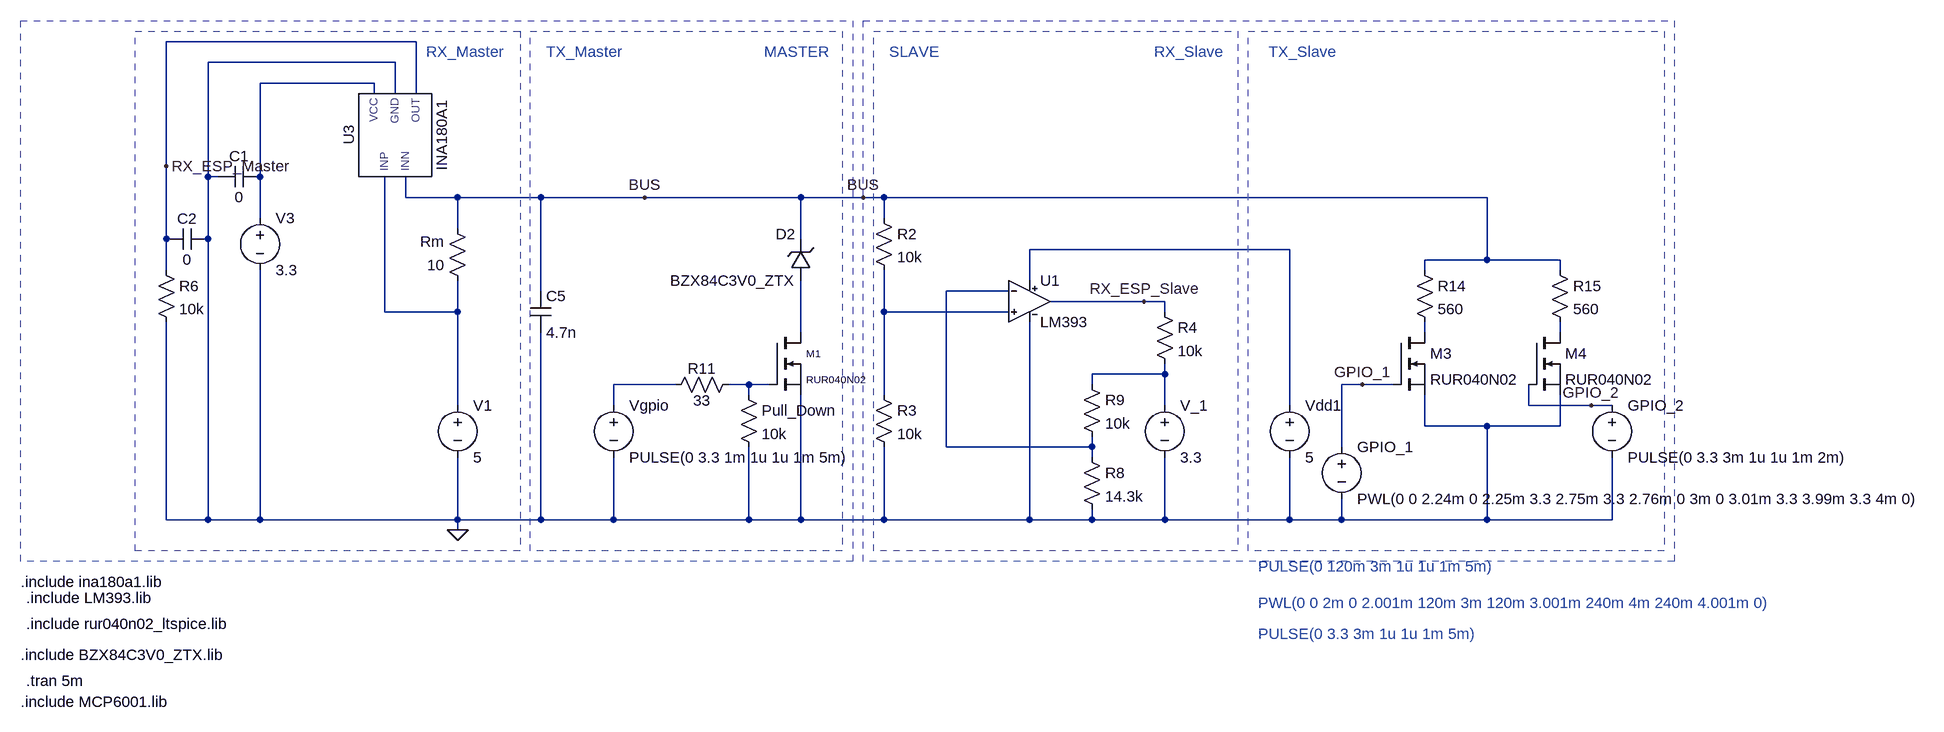
[diagram p0: schematic Master_Slave_Zwischenergebnis28052026.asc]
Master_Slave_Zwischenergebnis28052026.asc, the LTspice schematic file:
Version 4.1
SHEET 1 3916 744
WIRE -16 -288 -400 -288
WIRE -48 -256 -336 -256
WIRE -80 -224 -256 -224
WIRE -80 -208 -80 -224
WIRE -48 -208 -48 -256
WIRE -16 -208 -16 -288
WIRE -400 -96 -400 -288
WIRE -336 -80 -336 -256
WIRE -320 -80 -336 -80
WIRE -256 -80 -256 -224
WIRE -32 -48 -32 -80
WIRE 48 -48 -32 -48
WIRE 176 -48 48 -48
WIRE 336 -48 176 -48
WIRE 576 -48 336 -48
WIRE 672 -48 576 -48
WIRE 704 -48 672 -48
WIRE 1632 -48 704 -48
WIRE -256 -16 -256 -80
WIRE 704 -16 704 -48
WIRE 48 0 48 -48
WIRE -400 16 -400 -96
WIRE -336 16 -336 -80
WIRE 576 16 576 -48
WIRE 1328 32 928 32
WIRE 1632 48 1632 -48
WIRE 1632 48 1536 48
WIRE 1744 48 1632 48
WIRE -400 64 -400 16
WIRE 1536 64 1536 48
WIRE 1744 64 1744 48
WIRE 928 80 928 32
WIRE 176 96 176 -48
WIRE 896 96 800 96
WIRE 1104 112 960 112
WIRE 1136 112 1104 112
WIRE -64 128 -64 -80
WIRE 48 128 48 80
WIRE 48 128 -64 128
WIRE 704 128 704 64
WIRE 896 128 704 128
WIRE 1136 128 1136 112
WIRE 576 160 576 80
WIRE 1536 160 1536 144
WIRE 1744 160 1744 144
WIRE 1136 224 1136 208
WIRE 1136 224 1024 224
WIRE 384 240 288 240
WIRE 496 240 464 240
WIRE 528 240 496 240
WIRE 1024 240 1024 224
WIRE 1440 240 1408 240
WIRE 1488 240 1440 240
WIRE 496 256 496 240
WIRE 704 256 704 128
WIRE 48 272 48 128
WIRE 288 272 288 240
WIRE 1136 272 1136 224
WIRE 1328 272 1328 32
WIRE 1696 272 1696 240
WIRE 1792 272 1696 272
WIRE 1824 272 1792 272
WIRE 1536 304 1536 256
WIRE 1632 304 1536 304
WIRE 1744 304 1744 256
WIRE 1744 304 1632 304
WIRE 800 336 800 96
WIRE 1024 336 1024 320
WIRE 1024 336 800 336
WIRE 1408 336 1408 240
WIRE 1024 352 1024 336
WIRE -400 448 -400 144
WIRE -336 448 -336 16
WIRE -336 448 -400 448
WIRE -256 448 -256 64
WIRE -256 448 -336 448
WIRE 48 448 48 352
WIRE 48 448 -256 448
WIRE 176 448 176 160
WIRE 176 448 48 448
WIRE 288 448 288 352
WIRE 288 448 176 448
WIRE 496 448 496 336
WIRE 496 448 288 448
WIRE 576 448 576 256
WIRE 576 448 496 448
WIRE 704 448 704 336
WIRE 704 448 576 448
WIRE 928 448 928 144
WIRE 928 448 704 448
WIRE 1024 448 1024 432
WIRE 1024 448 928 448
WIRE 1136 448 1136 352
WIRE 1136 448 1024 448
WIRE 1328 448 1328 352
WIRE 1328 448 1136 448
WIRE 1408 448 1408 416
WIRE 1408 448 1328 448
WIRE 1632 448 1632 304
WIRE 1632 448 1408 448
WIRE 1824 448 1824 352
WIRE 1824 448 1632 448
WIRE 48 464 48 448
FLAG 48 464 0
FLAG 336 -48 BUS
FLAG -400 -96 RX_ESP_Master
FLAG 672 -48 BUS
FLAG 1104 112 RX_ESP_Slave
FLAG 1440 240 GPIO_1
FLAG 1792 272 GPIO_2
SYMBOL voltage 48 256 R0
SYMATTR InstName V1
SYMATTR Value 5
SYMBOL res 64 96 R180
WINDOW 0 36 76 Left 2
WINDOW 3 36 40 Left 2
SYMATTR InstName Rm
SYMATTR Value 10
SYMBOL lib\\sym\\EIT_Semiconductors\\nmos 528 160 R0
WINDOW 0 56 32 Left 1
WINDOW 3 56 72 Left 1
SYMATTR InstName M1
SYMATTR Value RUR040N02
SYMATTR Prefix X
SYMBOL voltage 288 256 R0
SYMATTR Value PULSE(0 3.3 1m 1u 1u 1m 5m)
SYMATTR InstName Vgpio
SYMBOL zener 592 80 R180
WINDOW 0 24 72 Left 2
WINDOW 3 24 0 Left 2
SYMATTR InstName D2
SYMATTR Value BZX84C3V0_ZTX
SYMBOL voltage 1328 256 R0
SYMATTR InstName Vdd1
SYMATTR Value 5
SYMBOL voltage 1136 256 R0
WINDOW 123 0 0 Left 0
WINDOW 39 0 0 Left 0
SYMATTR InstName V_1
SYMATTR Value 3.3
SYMBOL res 688 -32 R0
WINDOW 0 36 40 Left 2
WINDOW 3 36 76 Left 2
SYMATTR InstName R2
SYMATTR Value 10k
SYMBOL res 688 240 R0
WINDOW 0 36 40 Left 2
WINDOW 3 36 76 Left 2
SYMATTR InstName R3
SYMATTR Value 10k
SYMBOL res 1120 112 R0
WINDOW 0 36 40 Left 2
WINDOW 3 36 76 Left 2
SYMATTR InstName R4
SYMATTR Value 10k
SYMBOL INA180A1 -48 -144 R270
SYMATTR InstName U3
SYMBOL voltage -256 -32 R0
SYMATTR InstName V3
SYMATTR Value 3.3
SYMBOL res -416 48 R0
WINDOW 0 36 40 Left 2
WINDOW 3 36 76 Left 2
SYMATTR InstName R6
SYMATTR Value 10k
SYMBOL cap -256 -96 R90
WINDOW 0 0 32 VBottom 2
WINDOW 3 32 32 VTop 2
SYMATTR InstName C1
SYMATTR Value 0
SYMBOL cap -400 32 R270
WINDOW 0 32 32 VTop 2
WINDOW 3 0 32 VBottom 2
SYMATTR InstName C2
SYMATTR Value 0
SYMBOL LM393 928 112 R0
SYMATTR InstName U1
SYMATTR SpiceModel ""
SYMBOL res 1008 336 R0
WINDOW 0 36 40 Left 2
WINDOW 3 36 76 Left 2
SYMATTR InstName R8
SYMATTR Value 14.3k
SYMBOL res 1008 224 R0
WINDOW 0 36 40 Left 2
WINDOW 3 36 76 Left 2
SYMATTR InstName R9
SYMATTR Value 10k
SYMBOL cap 160 96 R0
WINDOW 0 24 8 Left 2
WINDOW 3 24 64 Left 2
SYMATTR InstName C5
SYMATTR Value 4.7n
SYMBOL res 368 256 R270
WINDOW 0 25 56 VTop 2
WINDOW 3 7 56 VBottom 2
SYMATTR InstName R11
SYMATTR Value 33
SYMBOL EIT_Semiconductors\\nmos 1488 160 R0
WINDOW 0 56 32 Left 2
WINDOW 3 56 72 Left 2
SYMATTR InstName M3
SYMATTR Value RUR040N02
SYMATTR Prefix X
SYMBOL EIT_Semiconductors\\nmos 1696 160 R0
WINDOW 0 56 32 Left 2
WINDOW 3 56 72 Left 2
SYMATTR InstName M4
SYMATTR Value RUR040N02
SYMATTR Prefix X
SYMBOL voltage 1408 320 R0
WINDOW 123 0 0 Left 0
WINDOW 39 0 0 Left 0
SYMATTR InstName GPIO_1
SYMATTR Value PWL(0 0 2.24m 0 2.25m 3.3 2.75m 3.3 2.76m 0 3m 0 3.01m 3.3 3.99m 3.3 4m 0)
SYMBOL voltage 1824 256 R0
WINDOW 123 0 0 Left 0
WINDOW 39 0 0 Left 0
SYMATTR InstName GPIO_2
SYMATTR Value PULSE(0 3.3 3m 1u 1u 1m 2m)
SYMBOL res 1520 48 R0
WINDOW 0 36 40 Left 2
WINDOW 3 36 76 Left 2
SYMATTR InstName R14
SYMATTR Value 560
SYMBOL res 1728 48 R0
WINDOW 0 36 40 Left 2
WINDOW 3 36 76 Left 2
SYMATTR InstName R15
SYMATTR Value 560
SYMBOL res 480 240 R0
SYMATTR InstName Pull_Down
SYMATTR Value 10k
TEXT -616 608 Left 2 !.include rur040n02_ltspice.lib
TEXT -624 656 Left 2 !.include BZX84C3V0_ZTX.lib
TEXT -616 696 Left 2 !.tran 5m
TEXT 1280 520 Left 2 ;PULSE(0 120m 3m 1u 1u 1m 5m)
TEXT 1280 576 Left 2 ;PWL(0 0 2m 0 2.001m 120m 3m 120m 3.001m 240m 4m 240m 4.001m 0)
TEXT -616 568 Left 2 !.include LM393.lib
TEXT 520 -272 Left 2 ;MASTER
TEXT 712 -272 Left 2 ;SLAVE
TEXT -624 544 Left 2 !.include ina180a1.lib
TEXT -624 728 Left 2 !.include MCP6001.lib
TEXT 0 -272 Left 2 ;RX_Master
TEXT 184 -272 Left 2 ;TX_Master
TEXT 1120 -272 Left 2 ;RX_Slave
TEXT 1296 -272 Left 2 ;TX_Slave
TEXT 1280 624 Left 2 ;PULSE(0 3.3 3m 1u 1u 1m 5m)
RECTANGLE Normal 656 512 -624 -320 2
RECTANGLE Normal 1920 512 672 -320 2
RECTANGLE Normal 144 496 -448 -304 2
RECTANGLE Normal 640 496 160 -304 2
RECTANGLE Normal 1248 496 688 -304 2
RECTANGLE Normal 1904 496 1264 -304 2

The netlist it stands for:
* Master_Slave_Zwischenergebnis28052026.asc
V1 N004 0 5
Rm N004 BUS 10
X§M1 N006 N011 0 RUR040N02  ; pins D G S
Vgpio N010 0 PULSE(0 3.3 1m 1u 1u 1m 5m)
D2 N006 BUS BZX84C3V0_ZTX
Vdd1 N002 0 5
V_1 N009 0 3.3
R2 BUS N005 10k
R3 N005 0 10k
R4 RX_ESP_Slave N009 10k
X§U3 N004 BUS N001 0 RX_ESP_Master INA180A1  ; pins INP INN VCC GND OUT
V3 N001 0 3.3
R6 RX_ESP_Master 0 10k
C1 N001 0 0
C2 RX_ESP_Master 0 0
X§U1 N005 N003 N002 0 RX_ESP_Slave LM393  ; pins In+ In- V+ V- OUT
R8 N003 0 14.3k
R9 N009 N003 10k
C5 BUS 0 4.7n
R11 N010 N011 33
X§M3 N007 GPIO_1 0 RUR040N02  ; pins D G S
X§M4 N008 GPIO_2 0 RUR040N02  ; pins D G S
V§GPIO_1 GPIO_1 0 PWL(0 0 2.24m 0 2.25m 3.3 2.75m 3.3 2.76m 0 3m 0 3.01m 3.3 3.99m 3.3 4m 0)
V§GPIO_2 GPIO_2 0 PULSE(0 3.3 3m 1u 1u 1m 2m)
R14 BUS N007 560
R15 BUS N008 560
R§Pull_Down N011 0 10k
.model D D
.lib standard.dio
.include rur040n02_ltspice.lib
.include BZX84C3V0_ZTX.lib
.tran 5m
* PULSE(0 120m 3m 1u 1u 1m 5m)
* PWL(0 0 2m 0 2.001m 120m 3m 120m 3.001m 240m 4m 240m 4.001m 0)
.include LM393.lib
* MASTER
* SLAVE
.include ina180a1.lib
.include MCP6001.lib
* RX_Master
* TX_Master
* RX_Slave
* TX_Slave
* PULSE(0 3.3 3m 1u 1u 1m 5m)
.lib ina180a1.lib
.backanno
.end